# Altium project LM317_Module.PrjPcb
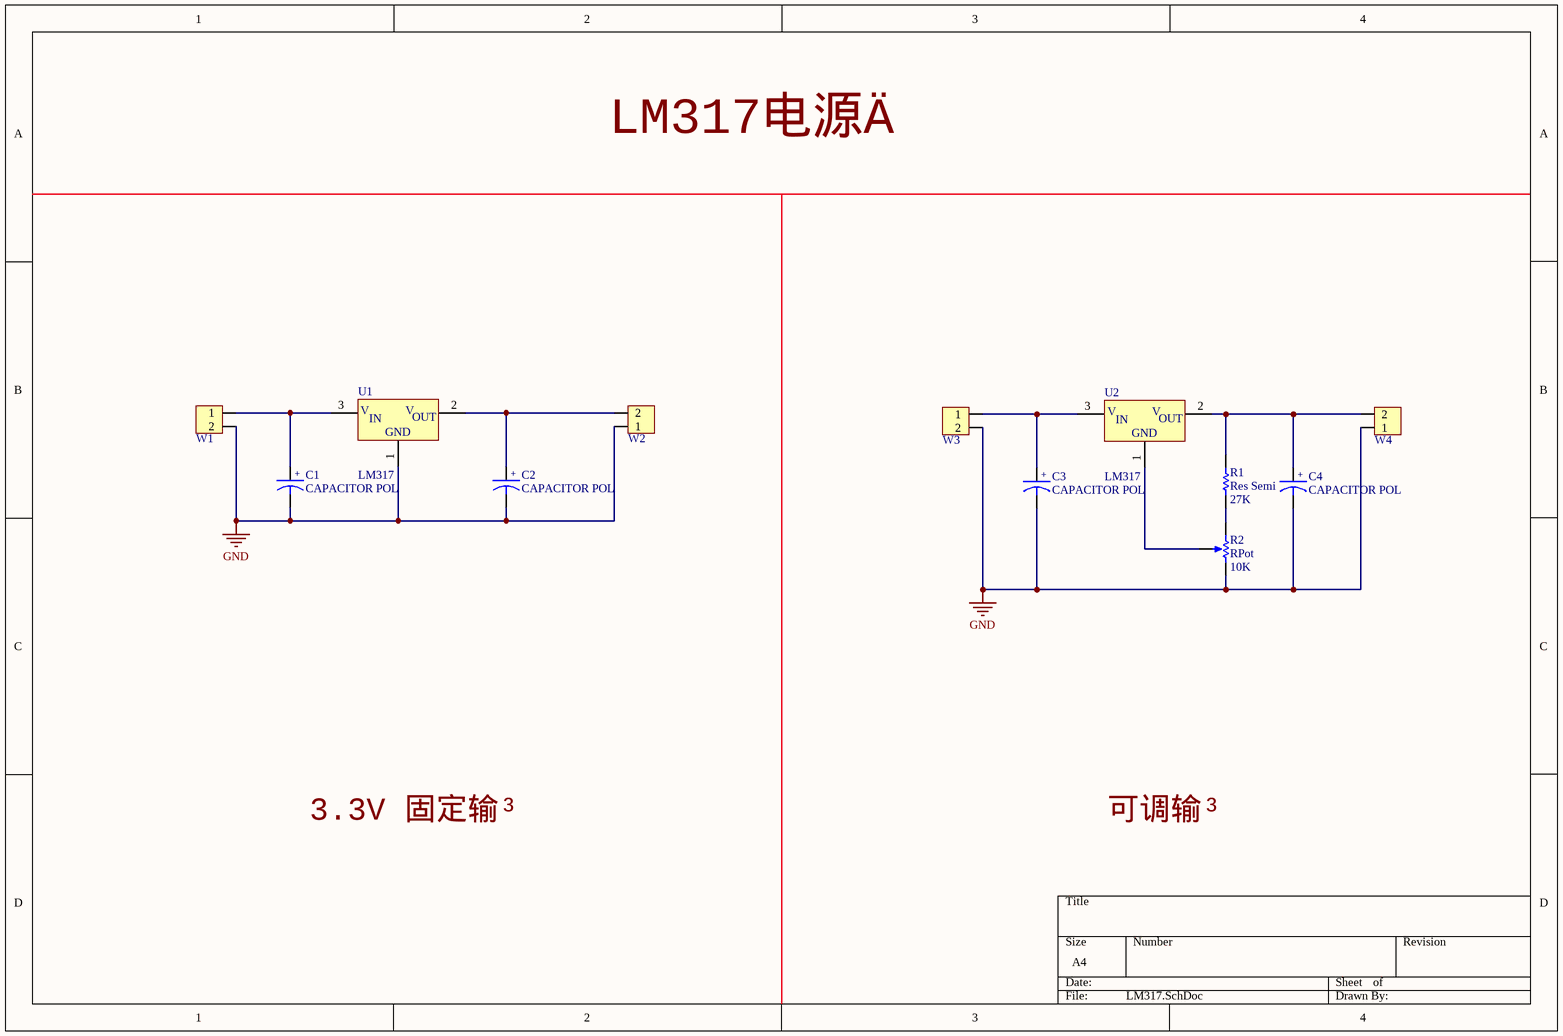
[diagram p0: LM317.SchDoc]
1 sheet, 12 parts. Net scope: global (net labels, ports and power ports of the same name join across sheets).
Board file: LM317.PcbDoc

## Sheet LM317.SchDoc
size A4

### Parts
C1  CAPACITOR POL  [Cap_Pol_F5]
C2  CAPACITOR POL  [Cap_Pol_F6]
C3  CAPACITOR POL  [Cap_Pol_F5]
C4  CAPACITOR POL  [Cap_Pol_F6]
R1  Res Semi  value 27K  [AXIAL-0.5]
R2  RPot  value 10K  [VR5]
U1  LM317  [78XX]
U2  LM317  [78XX]
W1  2Way_5  [2Way_5]  (value not drawn)
W2  2Way_5  [2Way_5]  (value not drawn)
W3  2Way_5  [2Way_5]  (value not drawn)
W4  2Way_5  [2Way_5]  (value not drawn)

### Nets
GND: C1.2 C2.2 C3.2 C4.2 R2.2(BOT) U1.1(GND) W1.2 W2.1 W3.2 W4.1
NetC1_1: C1.1 U1.3(VIN) W1.1
NetC2_1: C2.1 U1.2(VOUT) W2.2
NetC3_1: C3.1 U2.3(VIN) W3.1
NetC4_1: C4.1 R1.1 U2.2(VOUT) W4.2
NetR1_2: R1.2 R2.1(TOP)
NetR2_3: R2.3(TAP) U2.1(GND)

### Notes on the sheet
- LM317电源Ä
- 3.3V 固定输³
- 可调输³
- (in symbol CAPACITOR POL) +
- (in symbol LM) V; IN; OUT

### Library data of the parts
C1 C2 C4 = CAPACITOR POL: Capacitor
C3 = CAPACITOR POL: 10uF
R1 = Res Semi: Semiconductor Resistor; Published: 8-Jun-2000; LatestRevisionDate: 17-Jul-2002; LatestRevisionNote: Re-released for DXP Platform.; PackageReference: AXIAL-0.5; Publisher: Altium Limited; PackageDescription: Axial Device, Thru-Hole; 2 Leads; 0.5 in Pin Spacing
R2 = RPot: Potentiometer; Sim Note: Enter the Resistance value and the set point into parameter fields.; Set Position: 0.5; Published: 8-Jun-2000; LatestRevisionDate: 17-Jul-2002; LatestRevisionNote: Re-released for DXP Platform.; PackageReference: VR5; Publisher: Altium Limited; PackageDescription: Variable Resistor, Thru-Hole; 3 Leads
U1 U2 = LM: LM317 电源芯片
W1-W4 = 2Way_5: DB